# EAGLE design DA14580_QFN40_0v5 (EAGLE 7.5.0)
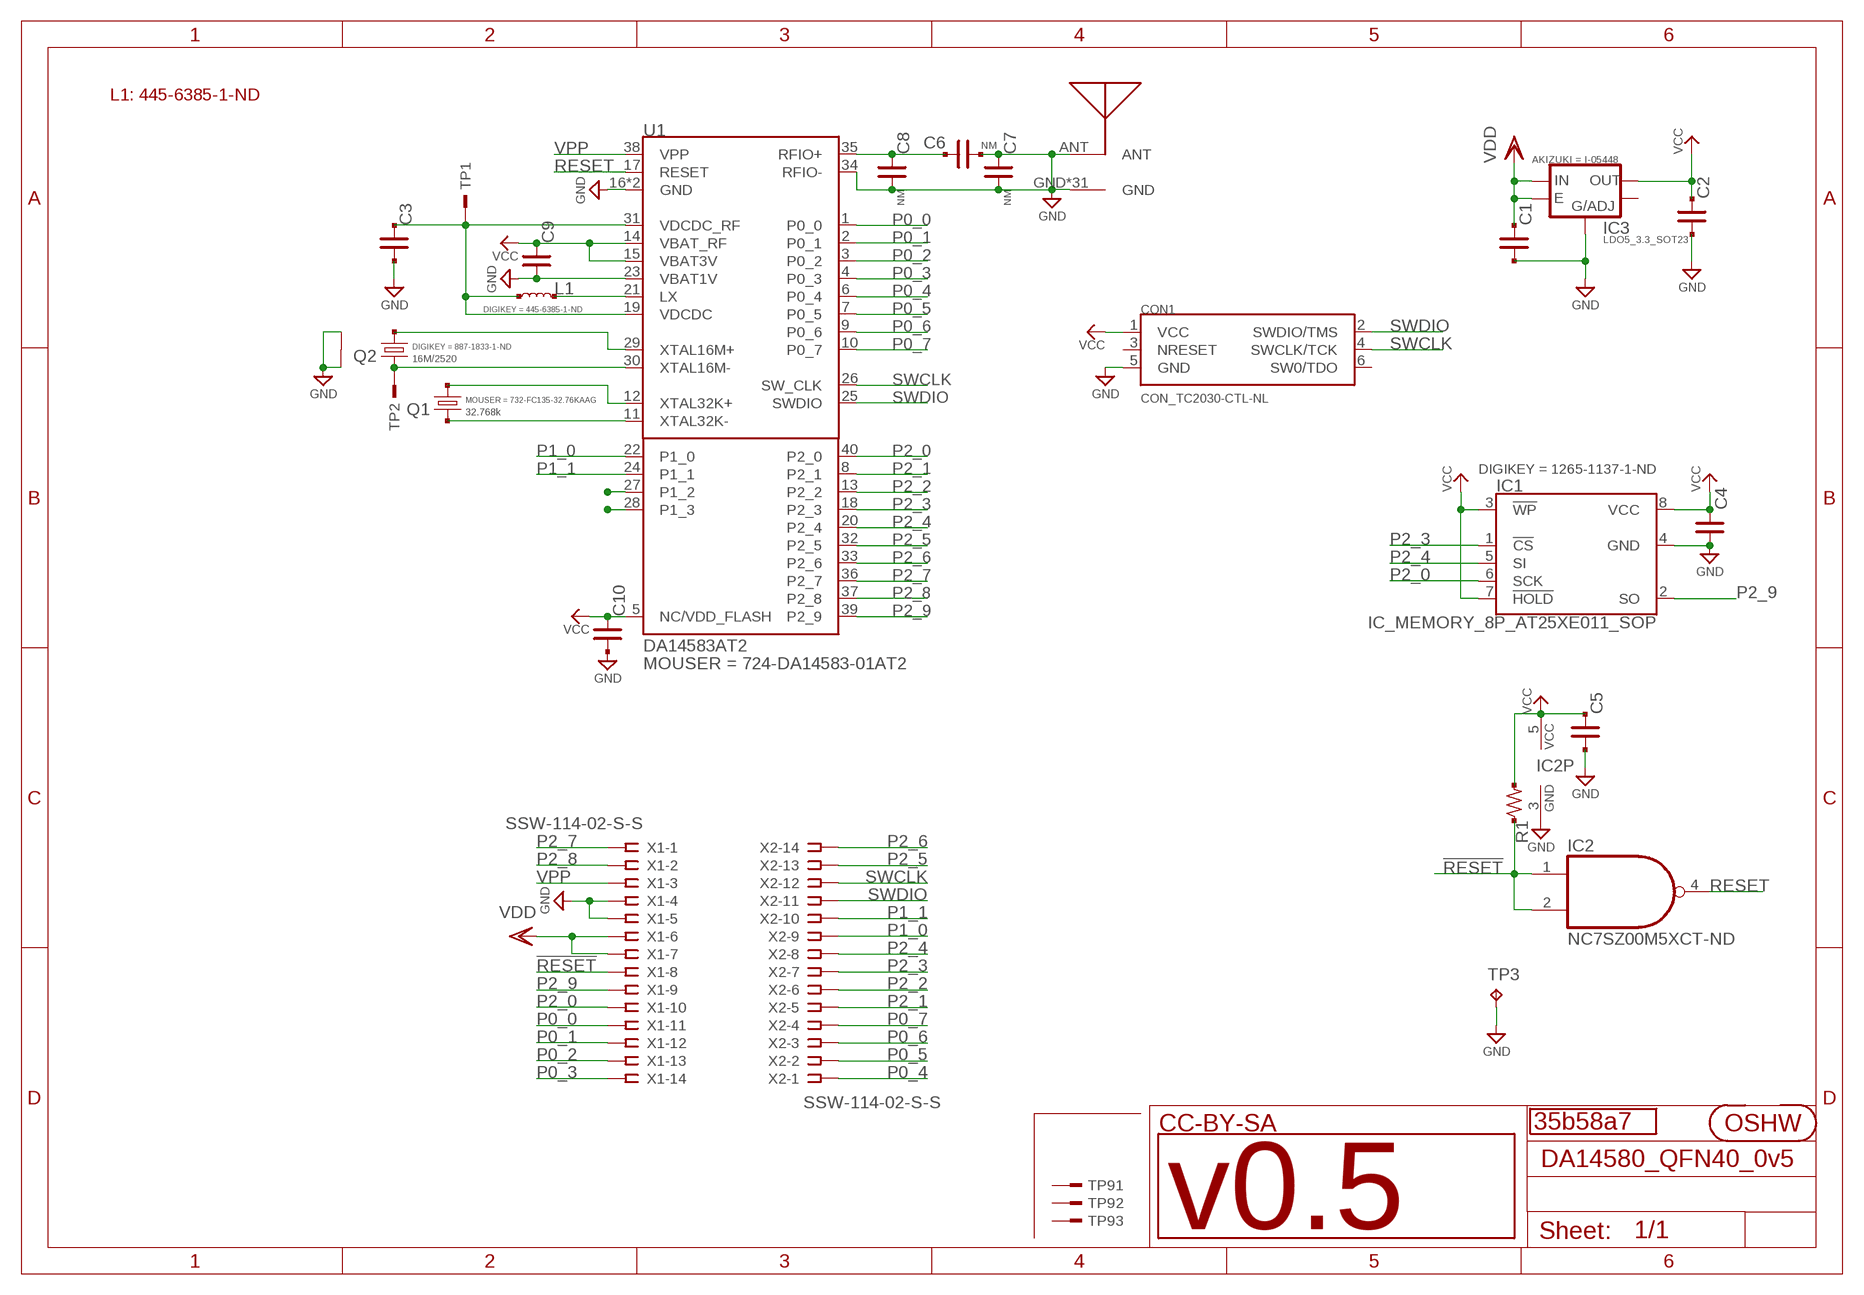
[diagram p0: schematic, sheet 1]

## Parts
C1  C_SMD_1.0U_1005  [C0402]
C2  C_SMD_1.0U_1005  [C0402]
C3  C_SMD_1.0U_1005  [C0402]
C4  C_SMD_0.1U_1005  [C0402]
C5  C_SMD_0.1U_1005  [C0402]
C6  NM  C_SMD_10P_1005  [C0402]
C7  NM  C_SMD__1005  [C0402]
C8  NM  C_SMD__1005  [C0402]
C9  C_SMD_1.0U_1005  [C0402]
C10  C_SMD_0.1U_1005  [C0402]
CON1  CON_TC2030-CTL-NL  [CON_TC2030-IDC-NL]
GIT1  35b58a7  GIT-REVISION  [GIT-REVISION]
IC1  IC_MEMORY_8P_AT25XE011_SOP  [IC_08_1.27_150MIL]
IC2  NC7SZ00M5XCT-ND  74LVC1G00DBV  [SOT23-5]
IC3  LDO5_3.3_SOT23  [IC_05_0.95_50MIL]
ICON1  v0.5  ICON_REVISION  [ICON_REVISION]
L1  INDUCTOR_2.2U_1608  [L_1608]
Q1  32.768k  CRYSTAL2_32.768K_FC-135  [CRYSTAL_FC-135]
Q2  16M/2520  CRYSTAL4_16M_2520  [CLOCK_2520]
R1  R_US_10K_1005  [C0402]
TP1  TESTPAD  [TP06RECT]
TP2  TESTPAD  [TP06RECT]
TP3  TPPAD1-13  [P1-13]
TP91  TESTPAD_F  [FIDUCIAL]
TP92  TESTPAD_F  [FIDUCIAL]
TP93  TESTPAD_F  [FIDUCIAL]
U1  DA14583AT2  [QFN40_0.4P5.0X5.0]
U$1  ANT_IFA  [ANT_IFA_V2]
U$2  ICON_OSHW  [ICON_OSHW]
X1  SSW-114-02-S-S  [SSW-114-02-S-S]
X2  SSW-114-02-S-S  [SSW-114-02-S-S]

## Nets
!RESET!: IC2.1(I0) IC2.2(I1) R1.1 X1.8
GND: C1.2 C2.2 C3.2 C4.2 C5.2 C6.2 C7.1 C7.2 C8.2 C9.2 C10.2 CON1.5(GND) IC1.4(GND) IC2.3(GND) IC3.2(ADJ) Q2.2 Q2.4 TP3.TP U1.16(GND) U1.23(VBAT1V) U1.34(RFIO-) U1.BP(GND) U$1.ANT U$1.GND U$1.GND@1(GND) U$1.GND@2(GND) U$1.GND@3(GND) U$1.GND@4(GND) U$1.GND@5(GND) U$1.GND@6(GND) U$1.GND@7(GND) U$1.GND@8(GND) U$1.GND@9(GND) U$1.GND@10(GND) U$1.GND@11(GND) U$1.GND@12(GND) U$1.GND@13(GND) U$1.GND@14(GND) U$1.GND@15(GND) U$1.GND@16(GND) U$1.GND@17(GND) U$1.GND@18(GND) U$1.GND@19(GND) U$1.GND@20(GND) U$1.GND@21(GND) U$1.GND@22(GND) U$1.GND@23(GND) U$1.GND@24(GND) U$1.GND@25(GND) U$1.GND@26(GND) U$1.GND@27(GND) U$1.GND@28(GND) U$1.GND@29(GND) U$1.GND@30(GND) X1.4 X1.5
N$1: C6.1 C8.1 U1.35(RFIO+)
N$6: L1.2 U1.21(LX)
N$9: C3.1 L1.1 TP1.TP U1.19(VDCDC) U1.31(VDCDC_RF)
N$18: Q1.1 U1.12(XTAL32K+)
N$19: Q1.2 U1.11(XTAL32K-)
N$20: Q2.1 U1.29(XTAL16M+)
N$21: Q2.3 TP2.TP U1.30(XTAL16M-)
P0_0: U1.1(P0_0) X1.11
P0_1: U1.2(P0_1) X1.12
P0_2: U1.3(P0_2) X1.13
P0_3: U1.4(P0_3) X1.14
P0_4: U1.6(P0_4) X2.1
P0_5: U1.7(P0_5) X2.2
P0_6: U1.9(P0_6) X2.3
P0_7: U1.10(P0_7) X2.4
P1_0: U1.22(P1_0) X2.9
P1_1: U1.24(P1_1) X2.10
P1_2: U1.27(P1_2)
P1_3: U1.28(P1_3)
P2_0: IC1.6(SCK) U1.40(P2_0) X1.10
P2_1: U1.8(P2_1) X2.5
P2_2: U1.13(P2_2) X2.6
P2_3: IC1.1(!CS) U1.18(P2_3) X2.7
P2_4: IC1.5(SI) U1.20(P2_4) X2.8
P2_5: U1.32(P2_5) X2.13
P2_6: U1.33(P2_6) X2.14
P2_7: U1.36(P2_7) X1.1
P2_8: U1.37(P2_8) X1.2
P2_9: IC1.2(SO) U1.39(P2_9) X1.9
RESET: IC2.4(O) U1.17(RESET)
SWCLK: CON1.4(SWCLK/TCK) U1.26(SW_CLK) X2.12
SWDIO: CON1.2(SWDIO/TMS) U1.25(SWDIO) X2.11
VCC: C2.1 C4.1 C5.1 C9.1 C10.1 CON1.1(VCC) IC1.3(!WP) IC1.7(!HOLD) IC1.8(VCC) IC2.5(VCC) IC3.5(OUT) R1.2 U1.5(NC/VDD_FLASH) U1.14(VBAT_RF) U1.15(VBAT3V)
VDD: C1.1 IC3.1(IN) IC3.3(E) X1.6 X1.7
VPP [power]: U1.38(VPP) X1.3
Unconnected: CON1.3(NRESET) CON1.6(SW0/TDO) IC3.4(OUT) TP91.TP TP92.TP TP93.TP

## Notes on the sheet
- L1: 445-6385-1-ND
- CC-BY-SA

## Library data of the parts
C1-C3 C9 = mylib:C_SMD_*: SMD CAPACITOR; DIGIKEY: 490-3890-1-ND
C4 C5 C10 = mylib:C_SMD_*: SMD CAPACITOR; DIGIKEY: 490-3261-1-ND
C6 = mylib:C_SMD_*: SMD CAPACITOR; DIGIKEY: 490-5921-1-ND
C7 C8 = mylib:C_SMD_*: SMD CAPACITOR
CON1 = mylib:CON_TC2030
GIT1 = git-revision:GIT-REVISION
IC1 = mylib:IC_MEMORY_8P_*; DIGIKEY: 1265-1137-1-ND
IC2 = 74xx-little-us_local:74*1G00: 2-input NAND gate
IC3 = mylib:LDO5_*; AKIZUKI: I-05448
ICON1 = mylib:ICON_REVISION; NOT_COMPONENT: YES
L1 = mylib:INDUCTOR_; DIGIKEY: 445-6385-1-ND
Q1 = mylib:CRYSTAL2_*; MOUSER: 732-FC135-32.76KAAG
Q2 = mylib:CRYSTAL4_*: Crystal 4 pins; DIGIKEY: 887-1833-1-ND
R1 = mylib:R_US_*: SMD resistor Packages : _1608 : 1.6 x 0.8 mm _2125 : 2.0 x 1.25 mm _3216 : 3.2 x 1.6 mm; DIGIKEY: P10.0KLCT-ND
TP1 TP2 TP91-TP93 = mylib:TESTPAD: test points; NOT_COMPONENT: YES
TP3 = testpad_local:TP: Test pad
U1 = mylib:DA1458*; MOUSER: 724-DA14583-01AT2
U$1 = mylib:ANT_IFA
U$2 = mylib:ICON_OSHW: Silk icon of OSHW; NOT_COMPONENT: YES
X1 X2 = con-samtec.local:SSW-114-02-S-S: THROUGH-HOLE .025" SQ POST SOCKET Source: Samtec SSW.pdf

## Net classes
0 signal: width 0.15 mm, drill 0.3 mm, clearance 0.15 mm
1 power: width 0.15 mm, drill 0.3 mm, clearance 0.15 mm

## Board
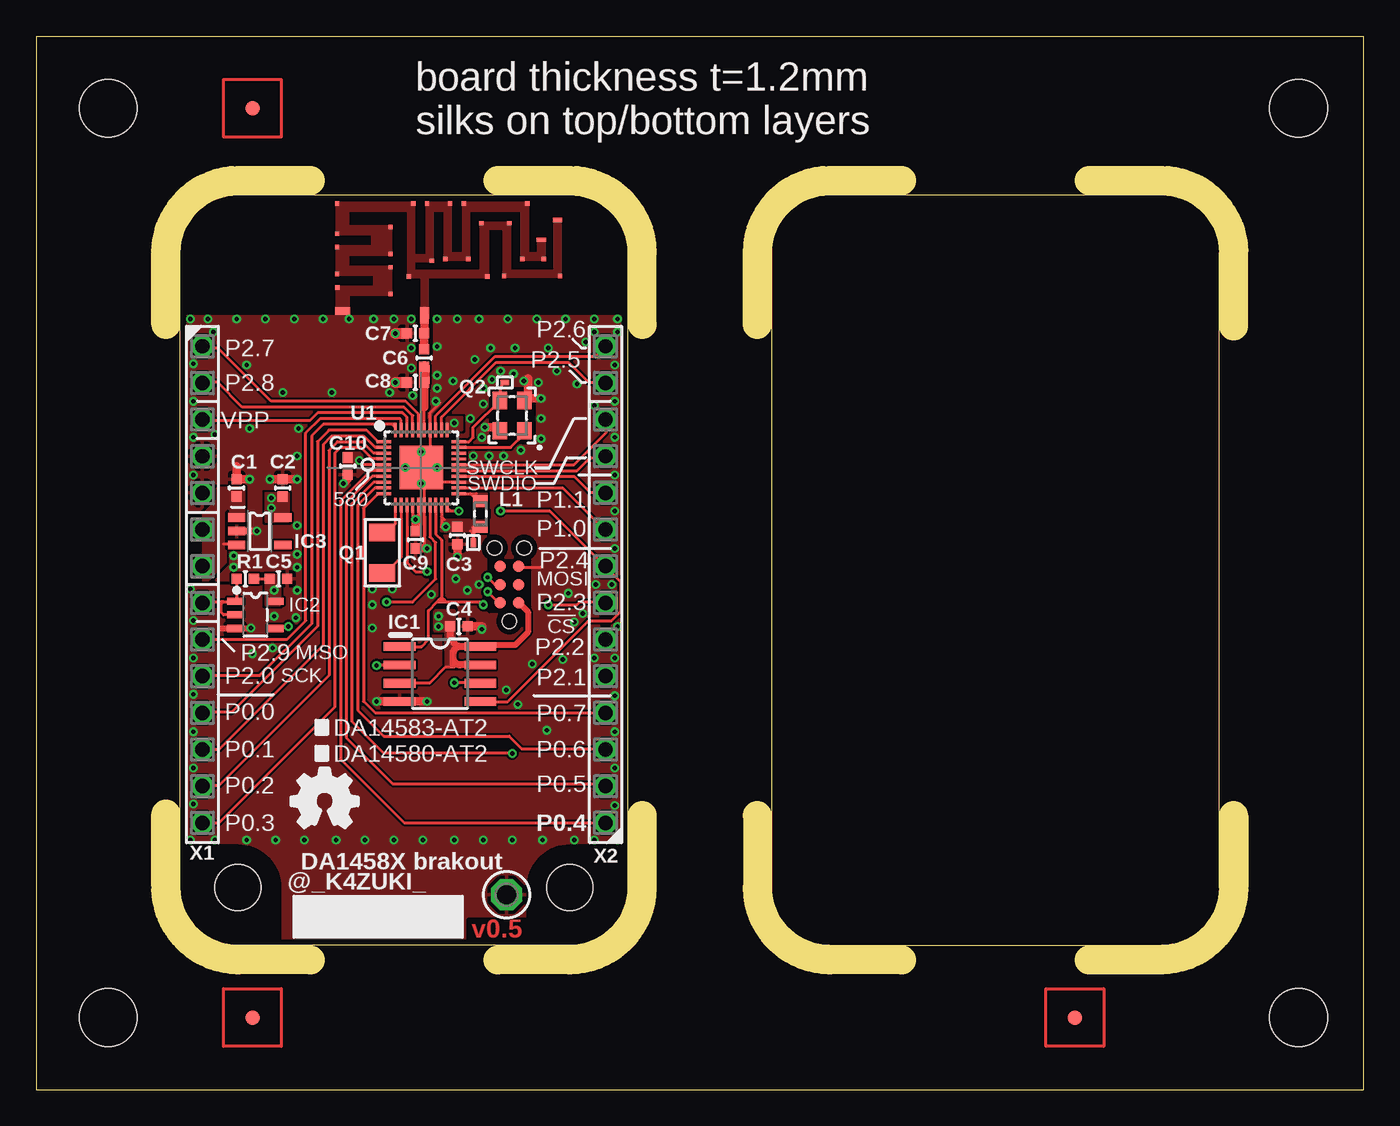
[diagram p1: board, top side]
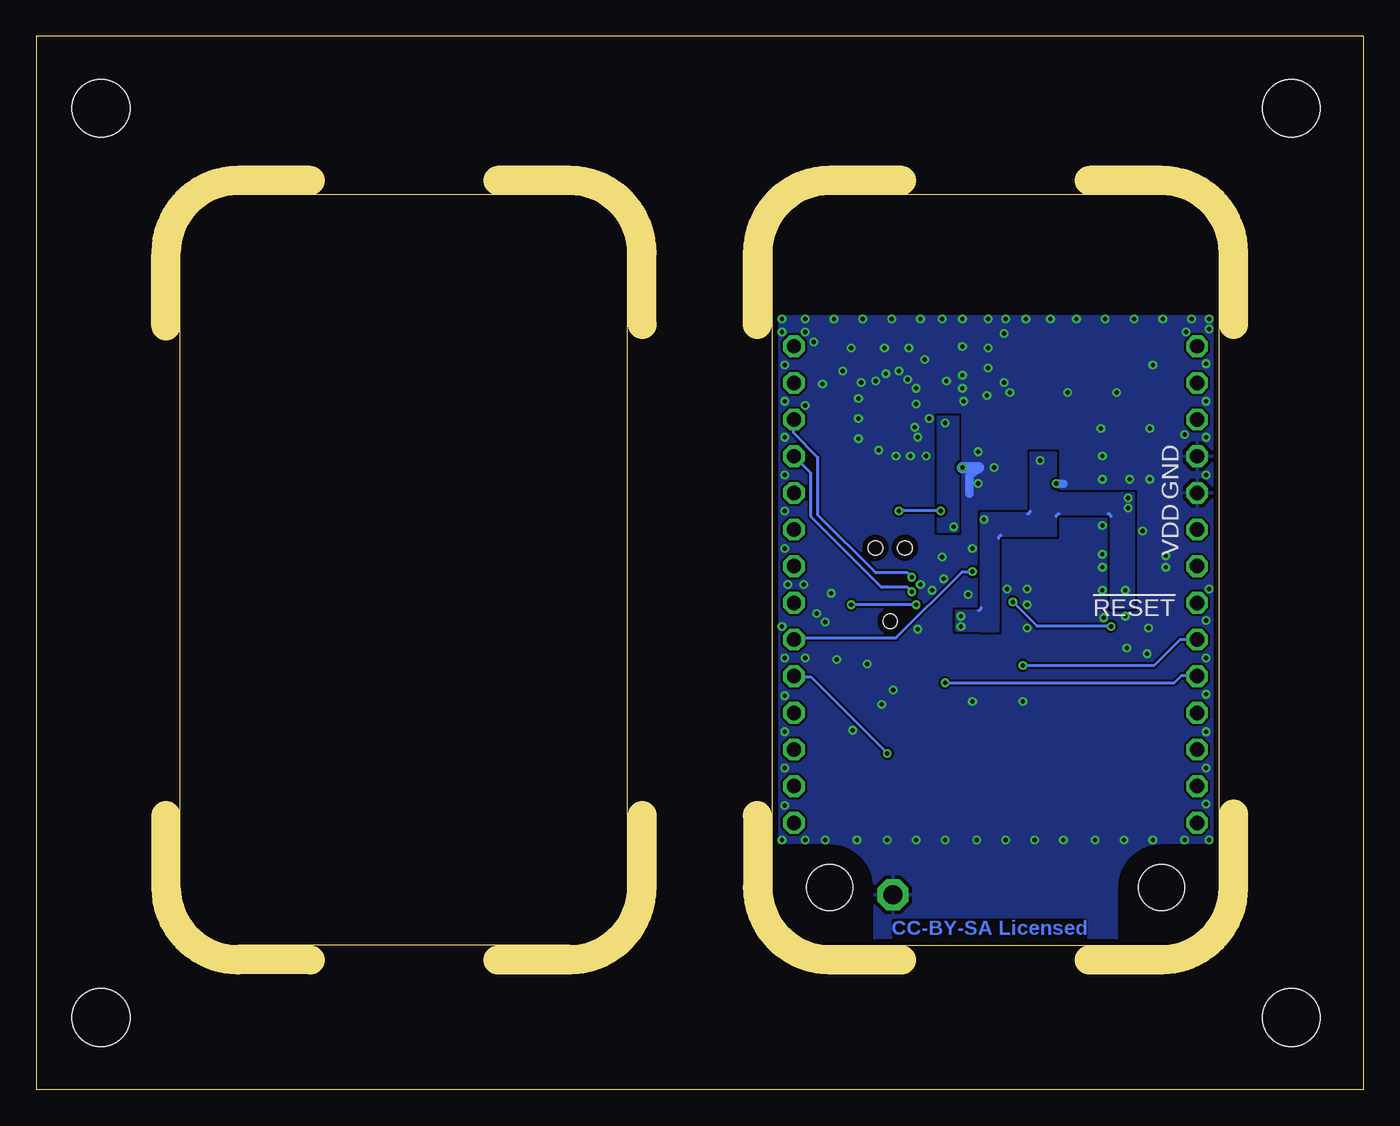
[diagram p2: board, bottom side, seen from below]

Size 92 x 73 mm. Coordinates in mm from the lower left corner, seen from the top.
Outline: 14,10 arc-90 10,14 10,58 arc-90 14,62 37,62 arc-90 41,58 41,14 arc-90 37,10 14,10
Outline: 0,73 92,73 92,0 0,0 0,73
Outline: 51,14 51,58 arc-90 55,62 78,62 arc-90 82,58 82,14 arc-90 78,10 55,10 arc-90 51,14
Copper layers (1*16): Top 0.0356mm / dielectric 1.5011mm / Bottom 0.0356mm
Design rules "SilverCircuits.2 *": minimum track width 0.15mm, minimum drill 0.3mm, track to track 0.15mm, track to pad 0.15mm, pad to pad 0.15mm, via to via 0.15mm, smd to smd 0mil, copper to edge 0.4mm, drill to drill 0.15mm, minimum pad ring 10mil, minimum via ring 0.15mm, stop-mask expansion 0.05mm, vias tented up to drill 100mil, thermal gap 10mil
Holes 3.2 mm at 14,14 37,14
Holes 4 mm at 5,5 5,68 87.5,68 87.5,5
tRestrict: area 23,36.8 to 24.8,37.6; area 30.2,39.6 to 31.4,40.2; area 31.5,44.8 to 34.5,48.6; area 10,10 to 17,17; area 34,10 to 41,17; area 10,53.7 to 20.2,62; area 37.2,53.7 to 41,62; area 26.3,50.5 to 27.5,53.8; area 31.4,33.1 to 34.2,36.7; 17 lines
bRestrict: area 34,10 to 41,17; area 10,10 to 17,17; area 10,53.7 to 20.2,62; area 37.2,53.7 to 41,62; 6 lines
Milling: 24 lines

### Footprints (pad centres in the part's own frame; a part is rotated, then mirrored left to right if it is on the bottom)
C0402 = smd 0.7 x 0.7: 1 -0.6,0; 2 0.6,0
CON_TC2030-IDC-NL = smd 0.787 x 0.787: 1 -1.27,-0.635; 2 -1.27,0.635; 3 0,-0.635; 4 0,0.635; 5 1.27,-0.635; 6 1.27,0.635 | hole 0.991: -2.54,0; 2.54,1.016; 2.54,-1.016
IC_08_1.27_150MIL = smd 0.6 x 2.2: 1 -1.905,-2.8; 2 -0.635,-2.8; 3 0.635,-2.8; 4 1.905,-2.8; 5 1.905,2.8; 6 0.635,2.8; 7 -0.635,2.8 | smd 0.603 x 2.2: 8 -1.905,2.8
SOT23-5 = smd 0.5 x 1.1: 1 -0.95,-1.4; 2 0,-1.4; 3 0.95,-1.4; 4 0.95,1.4; 5 -0.95,1.4
IC_05_0.95_50MIL = smd 0.6 x 1.2: 1 -0.95,-1.6; 2 0,-1.6; 3 0.95,-1.6; 4 0.95,1.6; 5 -0.95,1.6
L_1608 = smd 0.8 x 1: 1 -0.9,0; 2 0.9,0
CRYSTAL_FC-135 = smd 1.2 x 1.8: 1 -1.4,0; 2 1.4,0
CLOCK_2520 = smd 1.2 x 1: 1 -1.05,-0.85; 2 1.05,-0.85; 3 1.05,0.85; 4 -1.05,0.85
TP06RECT = smd 0.4 x 0.6: TP 0,0
P1-13 = drill 1.321 pad 2.159 octagon: TP 0,0
FIDUCIAL = smd 1 x 1: TP 0,0
QFN40_0.4P5.0X5.0 = smd 1 x 0.2: 1 -2.6,1.8; 2 -2.6,1.4; 3 -2.6,1; 4 -2.6,0.6; 5 -2.6,0.2; 6 -2.6,-0.2; 7 -2.6,-0.6; 8 -2.6,-1; 9 -2.6,-1.4; 10 -2.6,-1.8; 21 2.6,-1.8; 22 2.6,-1.4; 23 2.6,-1; 24 2.6,-0.6; 25 2.6,-0.2; 26 2.6,0.2; 27 2.6,0.6; 28 2.6,1; 29 2.6,1.4; 30 2.6,1.8 | smd 0.2 x 1: 11 -1.8,-2.6; 12 -1.4,-2.6; 13 -1,-2.6; 14 -0.6,-2.6; 15 -0.2,-2.6; 16 0.2,-2.6; 17 0.6,-2.6; 18 1,-2.6; 19 1.4,-2.6; 20 1.8,-2.6; 31 1.8,2.6; 32 1.4,2.6; 33 1,2.6; 34 0.6,2.6; 35 0.2,2.6; 36 -0.2,2.6; 37 -0.6,2.6; 38 -1,2.6; 39 -1.4,2.6; 40 -1.8,2.6 | smd 3 x 3: BP 0,0
ANT_IFA_V2 = smd 0.6 x 0.6: ANT 0.015,-0.3 | smd 1.02 x 0.5: GND -5.66,0.25 | smd 0.3 x 0.3: GND@1 -2.33,1.42; GND@3 -6.02,1.88; GND@4 -2.33,3.28; GND@5 -6.03,2.81; GND@6 -6.03,4.68; GND@7 -2.33,4.21; GND@8 -2.33,6.07; GND@9 -6.03,5.61; GND@10 -6.03,7.69; GND@11 -0.74,7.69; GND@12 -1.07,2.65; GND@13 4.37,2.65; GND@14 0.53,3.73; GND@15 0.2,7.69; GND@16 1.8,7.69; GND@17 1.47,3.86; GND@18 3.07,3.86; GND@19 2.74,7.69; GND@20 7.14,7.69; GND@21 3.97,6.33; GND@22 5.89,6.33; GND@23 5.54,2.67; GND@24 6.8,3.86; GND@25 8.28,3.86; GND@26 7.94,5.19; GND@27 8.28,5.19; GND@28 9.42,2.67; GND@29 9.08,6.56; GND@30 9.42,6.56 | smd 0.63 x 0.5: GND@2 0.015,0.25
SSW-114-02-S-S = drill 1 pad 1.5 octagon: 1 -16.51,0; 2 -13.97,0; 3 -11.43,0; 4 -8.89,0; 5 -6.35,0; 6 -3.81,0; 7 -1.27,0; 8 1.27,0; 9 3.81,0; 10 6.35,0; 11 8.89,0; 12 11.43,0; 13 13.97,0; 14 16.51,0

### Placement (x,y rotation side)
C1  13.9,41.7 90 top
C2  17.1,41.7 90 top
C3  29.2,38.4 270 top
C4  29.3,32.1 0 top
C5  16.8,35.4 0 top
C6  26.9,50.7 90 top
C7  26.3,52.4 180 top
C8  26.3,49 180 top
C9  26.3,38.1 270 top
C10  21.6,43.2 270 top
CON1  32.8,35 90 top
GIT1  -6.4,-13.5 0 top  (outside the outline)
IC1  28,28.8 270 top
IC2  15.2,32.9 270 top
IC3  15.5,38.7 270 top
ICON1  -1.2,-16.2 0 top  (outside the outline)
L1  30.8,39.9 90 top
Q1  24,37.2 90 top
Q2  33,46.7 90 top
R1  14.5,35.4 0 top
TP1  30.3,37.9 0 top
TP2  32.5,49 90 top
TP3  32.6,13.5 0 top
TP91  15,68 0 top
TP92  15,5 0 top
TP93  72,5 0 top
U1  26.7,43.1 0 top
U$1  26.9,53.7 0 top
U$2  20,20 0 top
X1  11.53,35 270 top
X2  39.47,35 90 top

### Tracks (layer width: path | path; a pad name or v marks a point on that pad's centre or on a via)
!RESET!
  Top 0.2: 12.8,33.8 12.8,33.6 | 12.8,33.6 12.8,33.1 13,32.9 IC2.2 | X1.8 11.6,33.8 12.6,33.8 | 12.6,33.8 12.8,33.8 | 12.6,33.8 12.8,33.6 | 12.8,33.6 13,33.8 | 13,33.8 12.8,33.8 | 13,33.8 13.75,33.8 IC2.1 13.9,33.95 R1.1
GND  (via drill 0.3)
  Top 0.2: U1.23 27.7,42.1 | 26.9,37.5 U1.16 26.9,41.8 v26.7,42 U1.BP 27.3,43.7 U1.34 27.3,46.9 28,47.6 | CON1.5 33.5,36.2 35,36.2
  Top 0.3: v14.9,32 12.8,32 12.8,31.9 14.9,31.9
  Top 0.5: v15.3,38.7 IC3.2
  Top 0.6: v35,47.9 34,47.9 Q2.2 | 34.1,49.3 34.1,48.3 | v31.1,45.9 31.9,45.9 Q2.4 | v21.3,42 21.6,42.3 C10.2 | U$1.ANT 26.91,52.41 C7.1 C6.2 | v27.1,37.5 C9.2 | v29.2,36.9 C3.2 | C4.2 30.9,32.1 v30.9,31.9 | v23.6,26.9 v27.1,26.9 | v14.8,42.3 C1.2 13.9,43.2 | v16.2,42.3 C2.2 v18.1,42.3
  Top 0.63: U$1.GND@2 U$1.ANT
  Top 0.75: v24.9,49 C8.2 | v24.9,52.4 C7.2
  Bottom 0.6: 27.3,41.3 27.3,42.5 U1.BP | v21.3,42 20.8,42
  Bottom 0.8: v27.8,43.1 U1.BP
  other vias: 33.8,49.1 30.3,43.9 31.4,43.9 32.4,43.9 33.6,44.3 30.9,45.2 30.1,46.5 31,47.5 31,48.6 33.1,49.6 34.8,49 35,46.5 35,45.1 18.1,34.6 31.6,49.2 19.9,53.4 21.7,53.4 17.9,53.4 13.9,53.4 15.9,53.4 23.4,53.4 10.7,53.4 11.9,53.4 26,53.4 29.2,53.4 30.7,53.4 10.9,50.3 10.9,47.7 10.9,45.2 10.9,42.6 10.9,32.5 10.9,29.9 10.9,27.4 40.1,50.2 40.1,47.7 40.1,45.2 40.1,42.6 40.1,40.1 40.1,37.5 39.9,35 40.3,32.1 40.1,29.9 10.7,52.7 40.3,52.5 27.8,53.4 27.8,49.5 27.8,51.5 32.7,53.4 34.7,53.4 36.7,53.4 38.7,53.4 40.3,53.4 26,51.4 26,50 27.7,47.7 10.9,24.8 10.9,22.3 10.9,19.8 10.7,17.3 12.4,17.3 26.1,48.1 18.6,17.3 14.6,17.3 16.6,17.3 26.8,17.3 24.8,17.3 20.8,17.3 22.8,17.3 33,17.3 29,17.3 31,17.3 38.7,17.3 40.3,17.3 35.1,17.3 37.3,17.3 40.1,27.3 40.1,24.8 40.1,22.3 40.1,19.7 24.8,53.4 27.8,48.6 12.3,52.5 14.6,50.2 17.1,48.3 20.5,48.3 24.5,48.3 28.9,49.1 30.4,50.6 31.5,51.4 33.2,51.4 35.5,51.4 38.1,51.8 38.7,52.5 38.7,47.4 37.5,48.9 36.1,49.8 12.4,45.4 18.2,45.8 14.8,45.8 18.1,43.9 18.1,39.1 18.1,37.1 18.1,36.2 18,32.7 16.5,32.8 16.4,30.6 15,30.2 29.1,35.4 29.9,34.6 30.7,35 36.9,34.4 38.8,35 23.3,32 23.3,34.7 23.3,33.6 24.7,34.7 27.4,34.3 37.9,33 37.3,32.4 10.7,34.7 32.6,27.7 34.4,29.5 33.4,26.7 36.5,29.8 38.7,29.9 35.4,24.9 13.7,37 13.7,36.2 26.7,44.2 25.6,43.1 32.2,49.8
  pour Top (rank 2): 10,62 41,62 41,10 10,10
  pour Bottom (rank 2): 10,62 41,62 41,10 10,10
  pour Top (no thermals): 30.1,44.8 35.2,44.8 35.2,49.2 30.1,49.2
  pour Bottom (no thermals): 24.7,42.7 26.7,42.7 26.7,43.5 24.7,43.5
  pour Bottom (no thermals): 27.1,43.1 27.1,45.1 26.3,45.1 26.3,43.1
  pour Bottom (no thermals): 27.1,41.1 27.1,43.1 26.3,43.1 26.3,41.1
N$1
  Top 0.2: U1.35 26.9,47.3
  Top 0.6: 26.9,47.3 C8.1
  Top 0.75: C6.1 C8.1
N$6
  Top 0.2: U1.21 30.1,41.3 | 30.1,41.3 30.5,41.3 | 30.1,41.3 30.4,41
  pour Top (no thermals): 30.4,41.3 31.2,41.3 31.2,40.4 30.4,40.4
N$9  (via drill 0.3)
  Top 0.2: U1.19 28.1,39.7 | 28.1,39.7 28.1,39 | 30.3,38.5 30.3,39 L1.1 | 28.1,39.7 28.3,39.5 | 30.3,38.5 30.1,38.7 | 30.3,38.5 30.5,38.7 | 30.3,38.5 TP1.TP
  other vias: 28.4,39 29,46.2
  pour Top (no thermals): 28.1,39.5 31.2,39.5 31.2,38.7 28.1,38.7
  pour Top (no thermals): 28.5,46.6 29.5,46.6 29.5,45.7 28.5,45.7
  pour Bottom (no thermals): 28.1,46.6 29.5,46.6 29.5,38.7 28.1,38.7
N$18
  Top 0.2: U1.12 25.3,36.9 24.3,35.9 Q1.1
N$19
  Top 0.2: U1.11 24.9,39.2 24.2,38.5 Q1.2
N$20
  Top 0.2: U1.29 32.9,44.5 33.85,45.45 Q2.1
N$21
  Top 0.2: U1.30 30,44.9 30.3,45.2 30.3,45.9 Q2.3 32.2,47.8 32.2,48.7 TP2.TP
P0_0
  Top 0.2: X1.11 11.53,26.13 11.6,26.2 13.6,26.2 19.5,32.1 19.5,44.9 20.3,45.7 22.9,45.7 23.7,44.9 U1.1
P0_1
  Top 0.2: U1.2 23.5,44.5 22.7,45.3 20.5,45.3 19.9,44.7 19.9,30.8 12.7,23.6 11.6,23.6 11.57,23.57 X1.12
P0_2
  Top 0.2: U1.3 23.4,44.1 22.6,44.9 20.9,44.9 20.3,44.3 20.3,28.7 12.7,21.1 11.7,21.1 11.63,21.03 X1.13
P0_3
  Top 0.2: U1.4 23.3,43.7 22.5,44.5 21.1,44.5 20.7,44.1 20.7,26.5 12.7,18.5 11.6,18.5 11.59,18.49 X1.14
P0_4
  Top 0.2: U1.6 23.2,42.9 21.1,40.8 21.1,22.9 25.5,18.5 X2.1
P0_5
  Top 0.2: U1.7 23.3,42.5 21.5,40.7 21.5,24.4 24.7,21.2 39.3,21.2 X2.2
P0_6
  Top 0.2: U1.9 23.5,41.7 22.3,40.5 22.3,26.3 24.1,24.5 32.8,24.5 33.7,23.6 39.4,23.6 39.43,23.57 X2.3
P0_7
  Top 0.2: X2.4 23.5,26.1 22.7,26.9 22.7,40.3 23.7,41.3 U1.10
P1_0
  Top 0.2: X2.9 39.38,38.9 39.3,38.9 36.5,41.7 U1.22
P1_1
  Top 0.2: U1.24 37.3,42.5 38.4,41.4 39.42,41.4 X2.10
P2_0  (via drill 0.3)
  Top 0.2: IC1.6 30.73,28.16 30.7,28.2 v29,28.2 | X1.10 11.55,28.65 11.6,28.7 15.5,28.7 19.1,32.3 19.1,45.3 19.9,46.1 24.7,46.1 | 24.7,46.1 24.9,46.1 24.9,45.9 | 24.9,45.9 U1.40 | 24.7,46.1 24.9,45.9
  Bottom 0.2: v29,28.2 13.1,28.2 12.6,28.7 11.58,28.7 X1.10
P2_1  (via drill 0.3)
  Top 0.2: v33,23.3 24.1,23.3 21.9,25.5 21.9,40.6 23.4,42.1 U1.8
  Bottom 0.2: X2.5 39.45,28.65 39.4,28.6 38.3,28.6 v33,23.3
P2_2  (via drill 0.3)
  Top 0.2: U1.13 25.7,36.5 26.3,35.9 v27.1,35.9
  Bottom 0.2: X2.6 39.41,31.19 39.3,31.3 32.4,31.3 27.8,35.9 v27.1,35.9
P2_3  (via drill 0.3)
  Top 0.2: IC1.1 26.7,30.7 27.2,31.2 27.2,33.2 27.8,33.8 | 27.8,33.8 27.9,33.9 | 27.9,33.9 28.1,34.1 | U1.18 27.7,38.5 28.1,38.1 28.1,34.1 | 27.8,33.8 28.4,33.8 | 28.4,33.8 30.8,33.8 v31,33.6 | v35.5,33.6 37.5,33.6 37.7,33.8 39.4,33.8 X2.7 | 28.1,34.1 28.3,33.9 | 28.3,33.9 28.4,33.8 | 27.9,33.9 28.3,33.9
  Bottom 0.2: v31,33.6 v35.5,33.6
P2_4  (via drill 0.3, 0.3 pad 0.6)
  Top 0.2: IC1.5 32.7,26.89 38.3,32.5 39.9,32.5 40.5,33.1 40.5,35.2 39.5,36.2 39.5,36.3 X2.8 39.44,36.3 39.4,36.3 35.6,40.1 v32.2,40.1 | U1.20 28.5,40.3 | 28.5,40.3 28.5,40.1 28.7,40.1 | 28.7,40.1 v29.3,40.1 | 28.5,40.3 28.7,40.1
  Bottom 0.2: v29.3,40.1 v32.2,40.1
P2_5
  Top 0.2: U1.32 28.1,46.6 31.9,50.4 36.9,50.4 38.3,49 39.44,49 X2.13
P2_6
  Top 0.2: U1.33 27.7,46.7 31.8,50.8 38.76,50.8 X2.14 39.4,51.51 | 39.4,51.51 39.4,51.6 | 39.4,51.51 39.4,51.4
P2_7
  Top 0.2: U1.36 26.5,46.8 25.6,47.7 16.3,47.7 12.6,51.4 11.7,51.4 11.59,51.51 X1.1
P2_8
  Top 0.2: U1.37 26.1,46.7 25.5,47.3 14.3,47.3 12.6,49 11.56,49 X1.2 11.57,48.97 11.6,49
P2_9  (via drill 0.3)
  Top 0.2: IC1.2 25.2,29.4 v23.6,29.4 | U1.39 25.3,46.4 25.2,46.5 19.7,46.5 18.7,45.5 18.7,32.5 17.4,31.2 11.6,31.2 11.59,31.19 X1.9
  Bottom 0.2: v23.6,29.4 14.5,29.4 12.7,31.2 X1.9
RESET  (via drill 0.3)
  Top 0.2: U1.17 27.3,38.3 27.7,37.9 27.7,35.4 26.1,33.8 v24.3,33.8 | v17.5,32.1 17.4,32 16.65,32 IC2.4
  Bottom 0.2: v17.5,32.1 22.6,32.1 v24.3,33.8
SWCLK  (via drill 0.3 pad 0.6)
  Top 0.2: U1.26 37.3,43.3 39.5,45.5 39.5,46.3 39.4,46.4 39.4,46.43 X2.12 | CON1.4 31.8,35 v31.3,35.5
  Bottom 0.2: v31.3,35.5 31.6,35.8 33.8,35.8 37.8,39.8 37.8,43.8 39.5,45.5 39.5,46.4 X2.12
SWDIO  (via drill 0.3 pad 0.6)
  Top 0.2: X2.11 39.38,43.8 38.4,43.8 37.5,42.9 U1.25 | CON1.2 32.07,33.73 v31.3,34.5
  Bottom 0.2: v31.3,34.5 31.6,34.8 33.4,34.8 38.3,39.7 38.3,42.72 X2.11
VCC  (via drill 0.3)
  Top 0.2: R1.2 C5.1 | IC1.3 25.27,28.16 25.3,28.2 27.3,28.2 28.4,29.3 29,29.3 | U1.14 26.1,39.9 | 26.1,39.9 26.1,39.7 v26.3,39.5 26.5,39.7 26.5,39.9 | U1.15 26.5,39.9 | U1.5 22.7,43.3 v22.4,43.6 | 26.1,39.9 arc180 26.5,39.9
  Top 0.4: CON1.1 33.47,33.73 34.1,33.1 34.1,31.7 33.2,30.8 31.7,30.8 31.6,30.7 31.59,30.7 IC1.8
  Top 0.5: IC1.7 29.4,29.43 arc-90 28.9,29.93 | IC1.8 29.4,30.7 | 29.4,30.7 arc90 28.9,30.2 28.9,29.93 | 28.9,29.5 28.9,29.93 | 29.4,30.7 29.39,30.7 arc-90 28.9,31.2 28.7,31.2 C4.1
  Top 0.6: v26.3,39.5 C9.1
  Bottom 0.2: 23.3,39.9 arc-90 23.1,40.1 | 21.1,39.9 arc-90 21.3,39.7 | 17.5,39.7 arc-90 17.7,39.9 | 25.1,38.4 arc-90 25.3,38.2 | 26.7,33.2 arc-90 26.5,33.4
  other vias: 16.3,41 16.3,40.3 16.5,34.6 27.9,32.1 27.9,32.8
  pour Top (no thermals): 17.5,41.3 15.9,41.3 15.9,39.4 17.5,39.4
  pour Top (no thermals): 26.5,39.7 26.1,39.7 26.1,38.7 26.5,38.7
  pour Top (no thermals): 16.9,35.6 15.9,35.6 15.9,33.6 16.9,33.6
  pour Top (no thermals): 27.6,33.2 27.6,31.8 29,31.8 29,33.2
  pour Top (no thermals): 28.4,29.3 29,29.3 29,31.7 28.4,31.7
  pour Bottom: 17.5,41.3 17.5,33.4 15.9,33.4 15.9,41.3
  pour Bottom: 25.3,39.9 26.5,39.9 26.5,31.8 25.3,31.8
  pour Bottom (no thermals): 26.5,33.2 26.5,31.8 28.2,31.8 28.2,33.2
  pour Top (no thermals): 21.3,44.1 21.3,43.4 22.6,43.4 22.6,44.1
  pour Bottom: 21.3,44.1 23.1,44.1 23.1,38.4 21.3,38.4
  pour Bottom: 15.9,41.3 23.1,41.3 23.1,39.9 15.9,39.9
  pour Bottom: 21.3,39.9 26.5,39.9 26.5,38.4 21.3,38.4
VDD
  Top 0.2: IC3.3 13.85,37.75 13.8,37.8 13,37.8
  pour Top (no thermals): 12.6,41.7 14.4,41.7 14.4,39.4 12.6,39.4
  pour Top (no thermals): 11.6,39.9 13.1,41.4 13.1,36.5 11.6,35
VPP
  Top 0.2: X1.3 11.57,46.43 11.6,46.4 19,46.4 19.5,46.9 25.4,46.9 25.7,46.6 U1.38

### Text on the board
Top: v0.5
Bottom: CC-BY-SA Licensed
tPlace: board thickness t=1.2mm / silks on top/bottom layers | P2.6 | P2.7 | P2.5 | P2.8 | VPP | SWCLK | SWDIO | 580 | P1.1 | P1.0 | P2.4 | MOSI | P2.3 | !CS! | P2.2 | P2.9 | MISO | P2.0 | SCK | P2.1 | P0.0 | P0.7 | P0.1 | P0.6 | DA14583-AT2 / DA14580-AT2 | P0.2 | P0.5 | P0.3 | P0.4 | DA1458X brakout | @_K4ZUKI_
bPlace: GND | VDD | !RESET
Vscore: V-CUT | V-CUT | V-CUT | V-CUT | V-CUT | V-CUT